# EasyEDA Pro project ProProject_AT_START_L021_V1.0.epro, board AT-START-L021_V1.0
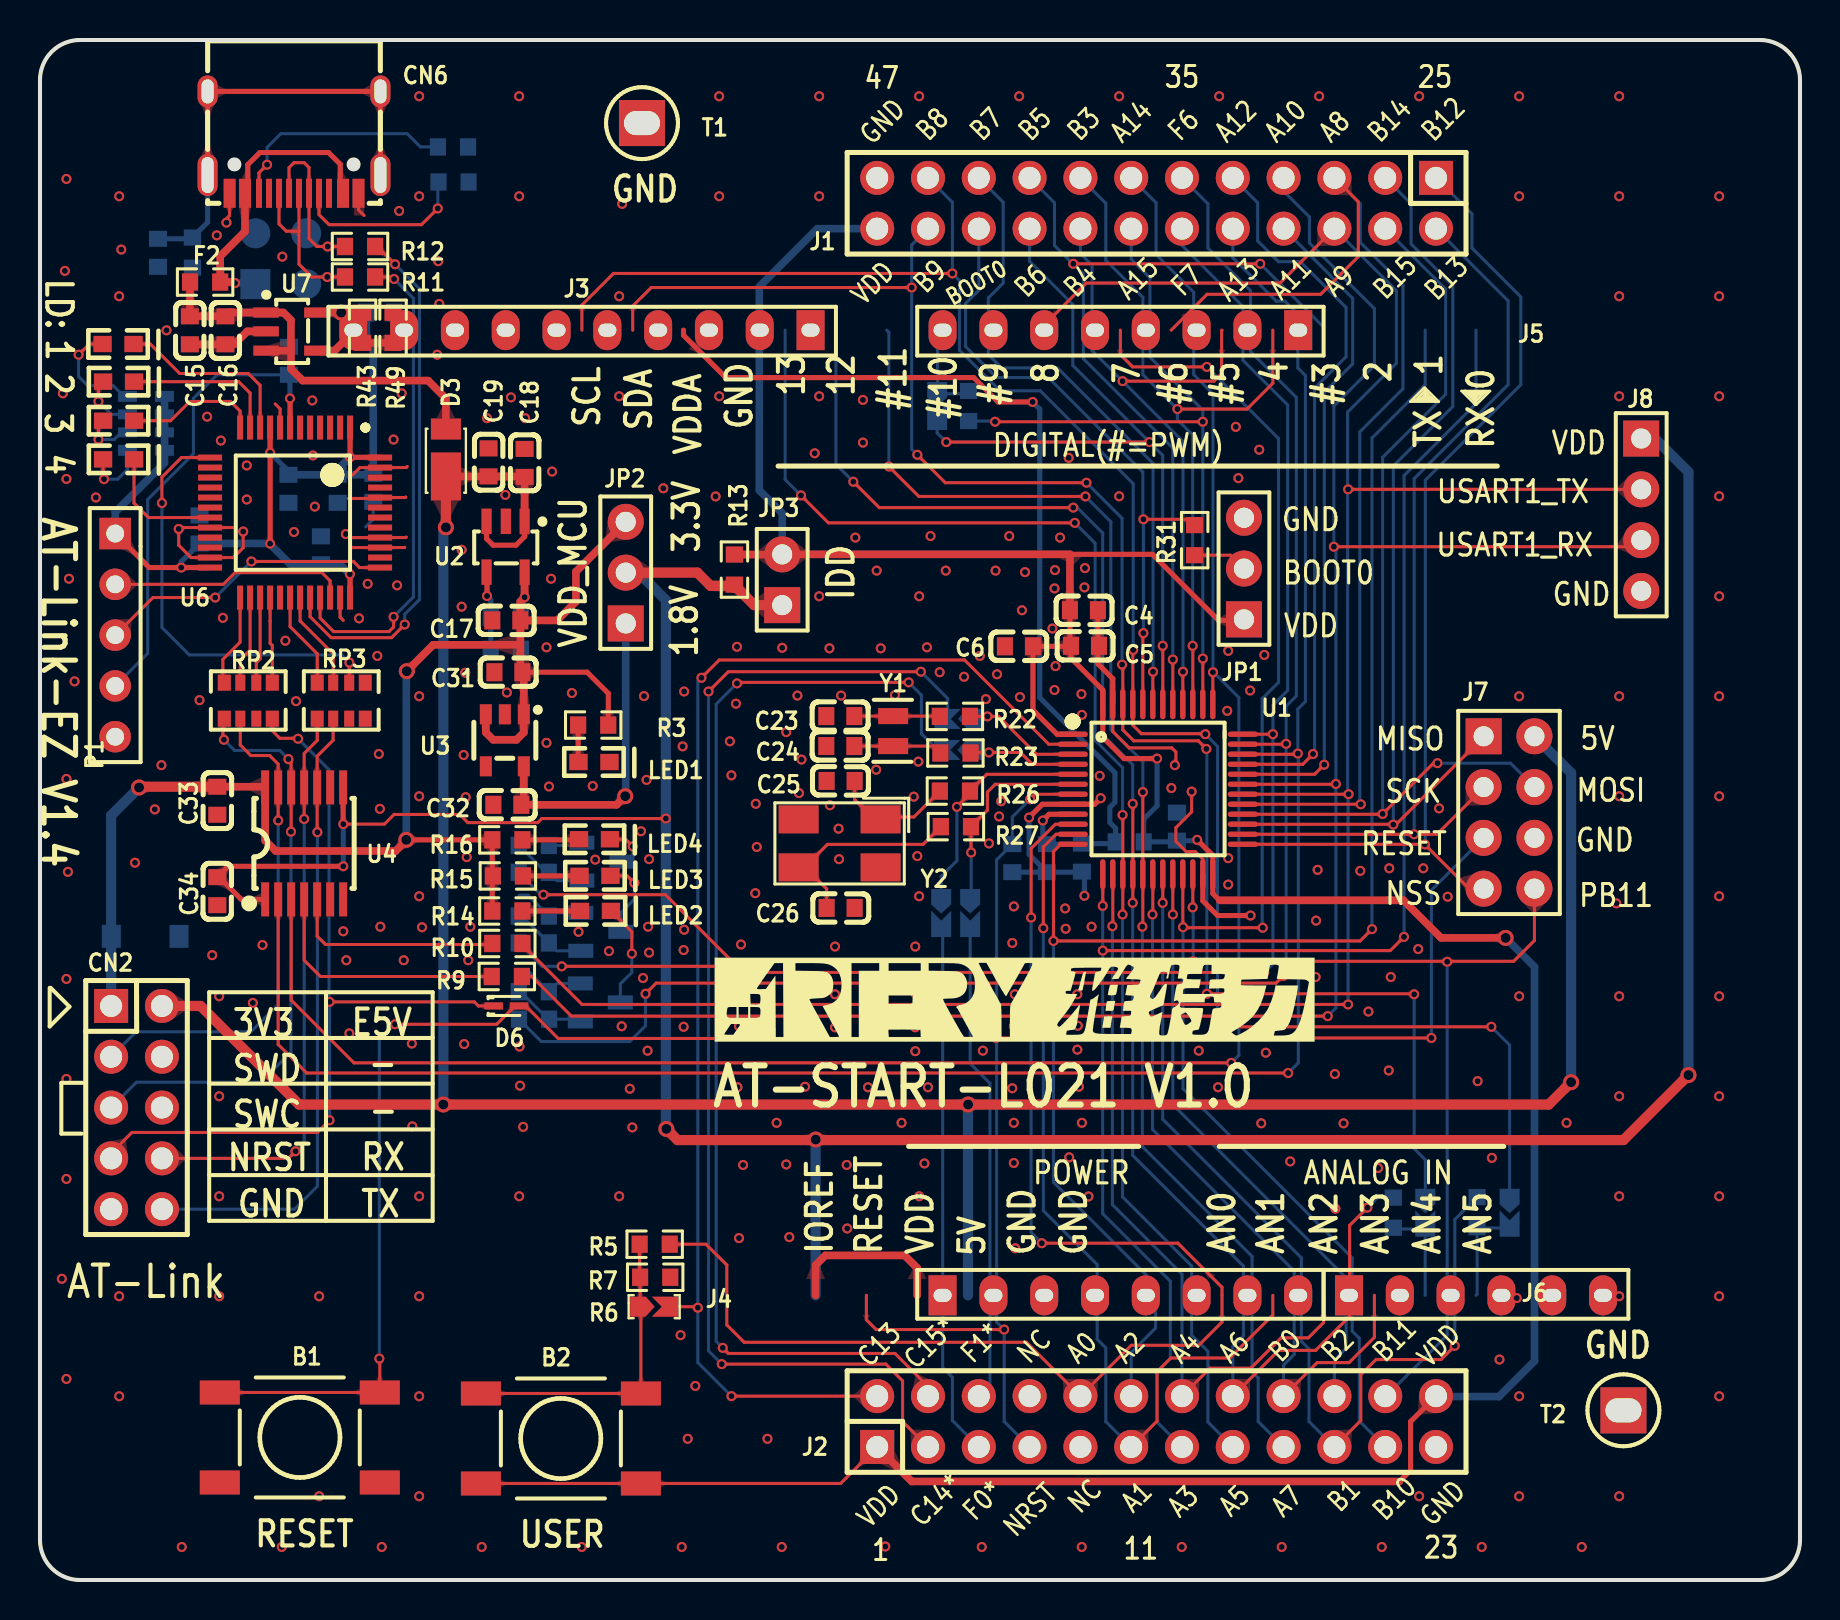
[diagram p4: board, top side]
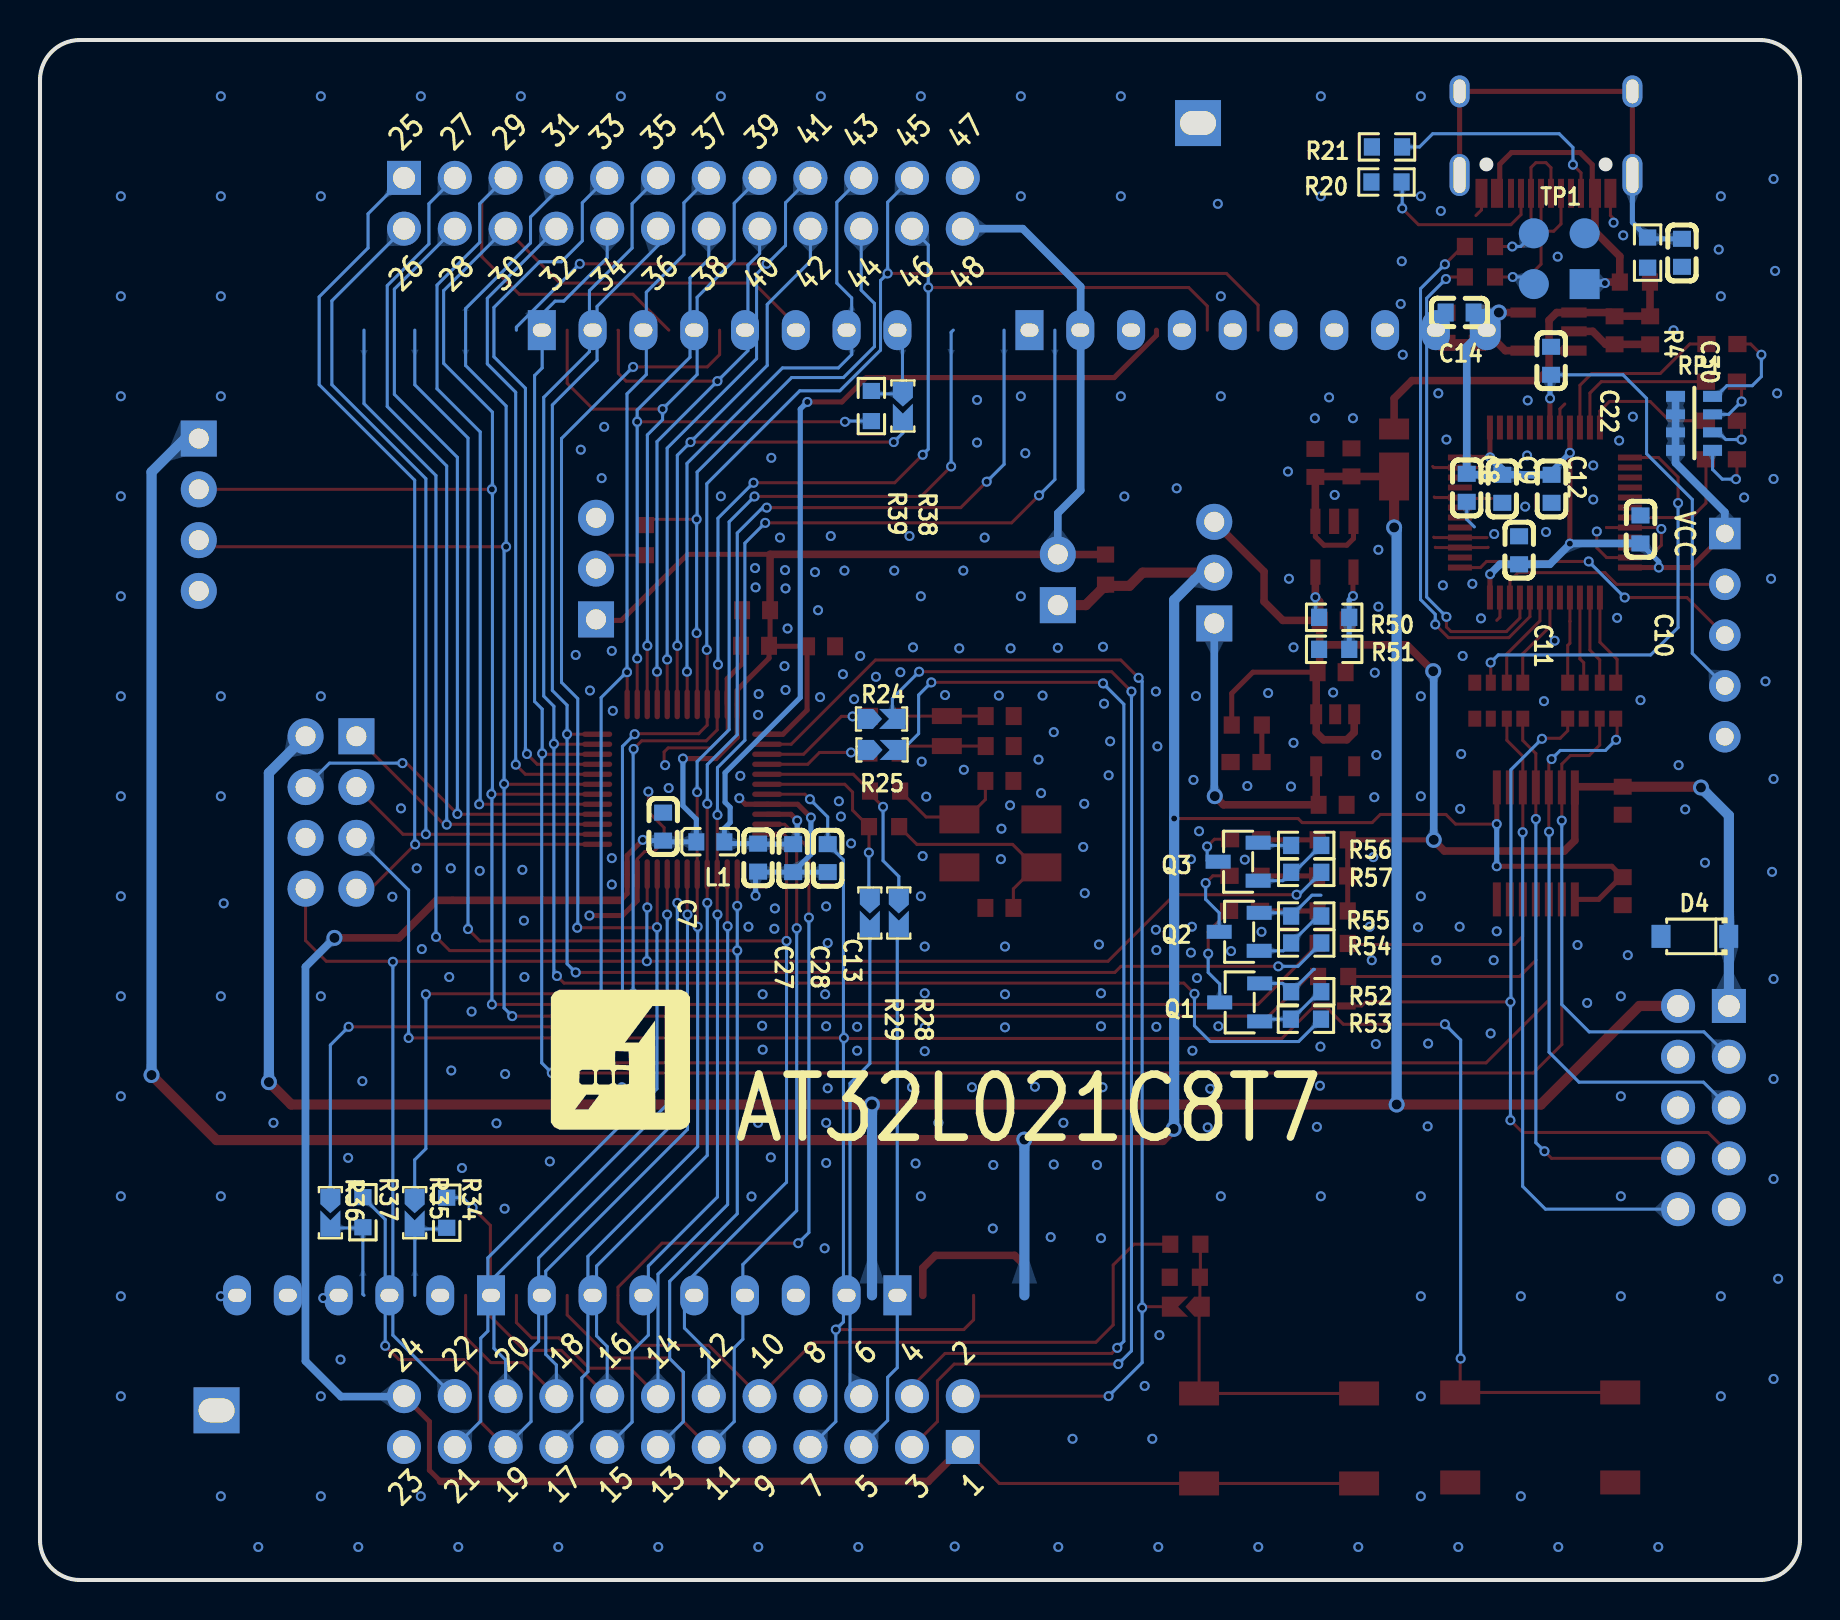
[diagram p5: board, bottom side, seen from below]

Outline 88 x 77 mm; copper layers: Top Layer, Bottom Layer. Coordinates in mm from the lower left corner of the outline.
Outline path: 0,75 0,2 arc(0.59,0.59) 2,0 86,0 arc(87.41,0.59) 88,2 88,75 arc(87.41,76.41) 86,77 2,77 arc(0.59,76.41) 0,75
Stack: Top Layer 0.035mm / Dielectric1 1.51mm FR4 er 4.5 / Bottom Layer 0.035mm

## Design rules (mm)
template: 用户自定义配置
spacing Default (default): track to track 0.152, other pairs 0 to 0.152
track width Default (default): min 0.152, default 0.152, max 25.4
differential pair differentialPair (default): width min 0.127, default 0.254, max 2.54; gap min 0.152, default 0.152
via Default (default): diameter min 0.5, default 0.5, max 100.025; hole min 0.3, default 0.3, max 59.995

## Placement (name value [footprint] x y rotation side)
B1  K2-1102SP-C4SC-04  [BUTTON_SMT_6*6*5]  12.99 7.13 0 top
B2  蓝色  [BUTTON_SMT_6*6*5]  26.05 7.08 180 top
C4  4.7uF  [C0603]  52.2 48.49 180 top
C5  100nF  [C0603]  52.25 46.71 180 top
C6  100nF  [C0603]  48.95 46.69 0 top
C7  100nF  [C0603]  56.84 37.67 270 bottom
C8  4.7uF  [C0603]  16.66 54.61 90 bottom
C9  100nF  [C0603]  14.88 54.56 90 bottom
C10  100nF  [C0603]  7.98 52.53 270 bottom
C11  100nF  [C0603]  14.05 51.49 270 bottom
C12  100nF  [C0603]  12.42 54.56 90 bottom
C13  100nF  [C0603]  48.62 36.09 90 bottom
C14  10uF  [C0603]  17.02 63.37 180 bottom
C15  10uF  [C0603]  7.49 62.48 90 top
C16  100nF  [C0603]  9.27 62.48 90 top
C17  10uF  [C0603]  23.32 47.98 0 top
C18  10uF  [C0603]  24.23 55.85 270 top
C19  100nF  [C0603]  22.43 55.88 270 top
C22  100nF  [C0603]  12.45 60.96 270 bottom
C23  18pF  [C0603]  40.02 43.2 0 top
C24  18pF  [C0603]  40.02 41.7 0 top
C25  33pF  [C0603]  40.03 39.95 0 top
C26  33pF  [C0603]  40.03 33.6 180 top
C27  1uF  [C0603]  52.1 36.12 90 bottom
C28  100nF  [C0603]  50.34 36.09 90 bottom
C30  100nF  [C0603]  5.9 66.36 90 bottom
C31  1uF  [C0603]  23.42 45.39 0 top
C32  1uF  [C0603]  23.37 38.76 0 top
C33  100nF  [C0603]  8.86 38.96 270 top
C34  100nF  [C0603]  8.86 34.44 90 top
CN2  -  [HDR-TH_10P-P2.54-V-M-R2-C5-S2.54]  4.83 23.62 270 top
CN6  -  [USB-C-SMD_TYPEC-304-BCP16]  12.7 71.88 180 top
D3  DFLS130L-7  [POWERDI-123_L2.8-W1.8-LS3.7-RD]  20.29 56.36 90 top
D4  SMF3.3A  [SOD-123_L2.8-W1.8-LS3.7-RD]  5.26 32.18 0 bottom
D6  LRB521S-40T1G  [SOD-523_L1.2-W0.8-LS1.6-RD]  23.32 28.7 0 top
F2  SMD0603B050TF  [R0603]  8.25 64.9 180 top
J1  -  [HDR-TH_24P-P2.54-V-M-R2-C12-S2.54]  55.83 68.84 180 top
J2  -  [HDR-TH_24P-P2.54-V-M-R2-C12-S2.54]  55.83 7.92 0 top
J3  -  [AT-START-Connector 1x10]  38.53 62.49 180 top
J4  -  [AT-START-Connector 1x8]  45.13 14.23 0 top
J5  -  [AT-START-Connector 1x8]  62.91 62.49 180 top
J6  -  [AT-START-Connector 1x6]  65.45 14.23 0 top
J7  Header 4X2  [HDR2X4]  72.18 42.19 270 top
J8  Header 1x4  [HDR1X4]  80.06 57.07 270 top
JP1  Header 1x3  [HEADER 1X3]  60.2 48.03 90 top
JP2  Header 1x3  [HEADER 1X3]  29.29 47.83 90 top
JP3  NC(Header 1x2)  [HDR1X2]  37.11 48.74 90 top
L1  600Ω@100MHz ±25%  [L0603]  54.48 36.91 180 bottom
LD1  RED  [LED0603]  3.13 61.79 0 top
LD2  GREEN  [LED0603]  3.15 59.91 0 top
LD3  BLUE  [LED0603]  3.16 57.96 0 top
LD4  YELLOW  [LED0603]  3.15 56.03 0 top
LED1  RED  [LED0603]  26.92 40.89 0 top
LED2  RED  [LED0603]  27 33.45 0 top
LED3  YELLOW  [LED0603]  26.97 35.2 0 top
LED4  GREEN  [LED0603]  26.95 37.03 0 top
P1  HDR-M-2.54_1x5  [HDR-M-2.54_1X5]  3.76 47.24 270 top
Q1  SS8050  [SOT-23-3_L2.9-W1.3-P1.90-LS2.4-BR]  28.02 28.88 180 bottom
Q2  SS8050  [SOT-23-3_L2.9-W1.3-P1.90-LS2.4-BR]  28.04 32.41 180 bottom
Q3  SS8050  [SOT-23-3_L2.9-W1.3-P1.90-LS2.4-BR]  28.09 35.92 180 bottom
R3  1kΩ  [R0603]  27.66 42.75 0 top
R4  1MΩ  [R0603]  7.62 66.37 270 bottom
R5  0Ω  [R0603]  30.73 16.79 0 top
R6  NC  [SB-PAD]  30.71 13.67 0 top
R7  100kΩ  [R0603]  30.76 15.14 180 top
R9  330Ω  [R0603]  23.34 30.17 0 top
R10  330Ω  [R0603]  23.37 31.83 0 top
R11  0Ω  [R0603]  16 65.15 0 top
R12  0Ω  [R0603]  16 66.67 0 top
R13  0Ω  [R0603]  34.72 50.52 90 top
R14  1kΩ  [R0603]  23.37 33.45 180 top
R15  1kΩ  [R0603]  23.39 35.2 180 top
R16  1kΩ  [R0603]  23.37 37.01 180 top
R20  5.1kΩ  [R0603]  20.68 69.9 0 bottom
R21  5.1kΩ  [R0603]  20.65 71.65 0 bottom
R22  0Ω  [R0603]  45.75 43.18 0 top
R23  0Ω  [R0603]  45.77 41.35 0 top
R24  NC  [SB-PAD]  45.92 43.05 180 bottom
R25  NC  [SB-PAD]  45.9 41.5 180 bottom
R26  0Ω  [R0603]  45.75 39.45 0 top
R27  0Ω  [R0603]  45.8 37.67 0 top
R28  NC  [SB-PAD]  45.06 33.35 270 bottom
R29  NC  [SB-PAD]  46.51 33.35 270 bottom
R31  10kΩ  [R0603]  57.73 51.99 90 top
R34  0Ω  [R0603]  67.67 18.36 270 bottom
R35  NC  [SB-PAD]  69.27 18.36 270 bottom
R36  NC  [SB-PAD]  73.48 18.36 270 bottom
R37  0Ω  [R0603]  71.86 18.39 270 bottom
R38  NC  [SB-PAD]  44.86 58.7 270 bottom
R39  0Ω  [R0603]  46.43 58.7 90 bottom
R43  47kΩ  [R0603]  16.13 62.61 90 top
R49  15kΩ  [R0603]  17.65 62.61 270 top
R50  47kΩ  [R0603]  23.29 48.13 0 bottom
R51  15kΩ  [R0603]  23.29 46.53 180 bottom
R52  100kΩ  [R0603]  24.69 29.41 180 bottom
R53  10kΩ  [R0603]  24.7 28.04 0 bottom
R54  10kΩ  [R0603]  24.69 31.85 0 bottom
R55  100kΩ  [R0603]  24.69 33.2 180 bottom
R56  100kΩ  [R0603]  24.69 36.73 180 bottom
R57  10kΩ  [R0603]  24.69 35.38 0 bottom
RP1  1K  [0603*4,8P4R]  6.22 59.18 270 bottom
RP2  330Ω  [RES-ARRAY-SMD_0603-8P-L3.2-W1.6-BL]  10.41 43.97 0 top
RP3  330Ω  [RES-ARRAY-SMD_0603-8P-L3.2-W1.6-BL]  15.06 43.97 0 top
T1  Testpoint  [TESTHOOK]  30.1 72.85 0 top
T2  Testpoint  [TESTHOOK]  79.17 8.48 180 top
TP1  1X4P_2.54F  [HDR1X4 - TOP]  13.31 62.25 270 bottom
U1  -  [LQFP-48_L7.0-W7.0-P0.50-LS9.0-BL]  55.89 39.54 270 top
U2  RT9080N-08GJ5  [SOT-23-5]  21.69 51.28 270 top
U3  ME6211C18M5G-N  [SOT-23-5_L3.0-W1.7-P0.95-LS2.8-BR]  23.24 41.99 90 top
U4  AIPTS0104TA14.TR  [TSSOP-14_L5.0-W4.4-P0.65-LS6.4-BL]  13.21 36.83 0 top
U6  AT32F403ACCT7  [LQFP48 - 2]  15.5 57.62 270 top
U7  RT9080N-08GJ5  [SOT-23-5(1)]  12.95 60.83 0 top
Y1  32.768KHz  [XTAL_SOP - FC-12M]  42.66 43.2 270 top
Y2  8MHz  [OSC-SMD_4P-L5.0-W3.2-BL]  39.98 36.83 180 top

## Footprints (pads in the part's own frame, mm; a bottom-side part is the same pattern mirrored in y, then rotated)
0603*4,8P4R
  rect 0.55x0.95 smd: 1(0,0) 4(2.7,0) 5(2.7,1.85) 8(0,1.85)
  rect 0.5x0.95 smd: 2(0.9,0) 3(1.8,0) 6(1.8,1.85) 7(0.9,1.85)
AT-START-Connector 1x6
  rect 1.4x2 hole 0.9x0.65: 1(0,0)
  oval 1.4x2 hole 0.9x0.65: 2(2.54,0) 3(5.08,0) 4(7.62,0) 5(10.16,0) 6(12.7,0)
AT-START-Connector 1x8
  rect 1.4x2 hole 0.9x0.65: 1(0,0)
  oval 1.4x2 hole 0.9x0.65: 2(2.54,0) 3(5.08,0) 4(7.62,0) 5(10.16,0) 6(12.7,0) 7(15.24,0) 8(17.78,0)
AT-START-Connector 1x10
  rect 1.4x2 hole 0.9x0.65: 1(0,0)
  oval 1.4x2 hole 0.9x0.65: 2(2.54,0) 3(5.08,0) 4(7.62,0) 5(10.16,0) 6(12.7,0) 7(15.24,0) 8(17.78,0) 9(20.32,0) 10(22.86,0)
BUTTON_SMT_6*6*5
  rect 2x1.2 smd: 1(-4,2.25) 2(4,2.25) 3(-4,-2.25) 4(4,-2.25)
C0603
  rect 0.8x0.9 smd: 1(-0.7,0) 2(0.7,0)
HDR1X2
  rect 1.8x1.8 hole 1.005x1: 1(0,0)
  round 1.8 hole 1.005x1: 2(2.54,0)
HDR1X4
  rect 1.8x1.8 hole 1: 1(0,0)
  round 1.8 hole 1: 2(2.54,0) 3(5.08,0) 4(7.62,0)
HDR1X4 - TOP
  rect 1.5x1.5 smd: 1(-2.54,2.54)
  round 1.5 smd: 2(-5.08,0) 3(-2.54,0) 4(-5.08,2.54)
HDR2X4
  rect 1.8x1.8 hole 1: 1(0,0)
  round 1.8 hole 1: 2(0,2.54) 3(2.54,0) 4(2.54,2.54) 5(5.08,0) 6(5.08,2.54) 7(7.62,0) 8(7.62,2.54)
HDR-M-2.54_1X5
  rect 1.575x1.575 hole 0.889: 1(-5.08,0)
  round 1.575 hole 0.889: 2(-2.54,0) 3(0,0) 4(2.54,0) 5(5.08,0)
HDR-TH_10P-P2.54-V-M-R2-C5-S2.54
  rect 1.7x1.7 hole 1.1: 1(-5.08,-1.27)
  round 1.7 hole 1.1: 2(-5.08,1.27) 3(-2.54,-1.27) 4(-2.54,1.27) 5(0,-1.27) 6(0,1.27) 7(2.54,-1.27) 8(2.54,1.27) 9(5.08,-1.27) 10(5.08,1.27)
HDR-TH_24P-P2.54-V-M-R2-C12-S2.54
  rect 1.7x1.7 hole 1.1: 1(-13.97,-1.27)
  round 1.7 hole 1.1: 2(-13.97,1.27) 3(-11.43,-1.27) 4(-11.43,1.27) 5(-8.89,-1.27) 6(-8.89,1.27) 7(-6.35,-1.27) 8(-6.35,1.27) 9(-3.81,-1.27) 10(-3.81,1.27) 11(-1.27,-1.27) 12(-1.27,1.27) 13(1.27,-1.27) 14(1.27,1.27) 15(3.81,-1.27) 16(3.81,1.27) 17(6.35,-1.27) 18(6.35,1.27) 19(8.89,-1.27) 20(8.89,1.27) 21(11.43,-1.27) 22(11.43,1.27) 23(13.97,-1.27) 24(13.97,1.27)
HEADER 1X3
  rect 1.8x1.8 hole 1.005x1: 1(0,-0.001)
  round 1.8 hole 1.005x1: 2(2.54,-0.001) 3(5.08,-0.001)
L0603
  rect 0.8x0.864 smd: 1(-0.701,0) 2(0.701,0)
LED0603
  rect 0.914x0.813 smd: 1(-0.001,0.005) 2(1.548,0.005)
LQFP48 - 2
  rect 1.2x0.3 smd: 1(0,0) 2(0,-0.5) 3(0,-1) 4(0,-1.5) 5(0,-2) 6(0,-2.5) 7(0,-3) 8(0,-3.5) 9(0,-4) 10(0,-4.5) 11(0,-5) 12(0,-5.5) 25(8.5,-5.5) 26(8.5,-5) 27(8.5,-4.5) 28(8.5,-4) 29(8.5,-3.5) 30(8.5,-3) 31(8.5,-2.5) 32(8.5,-2) 33(8.5,-1.5) 34(8.5,-1) 35(8.5,-0.5) 36(8.5,0)
  rect 0.3x1.2 smd: 13(1.5,-7) 14(2,-7) 15(2.5,-7) 16(3,-7) 17(3.5,-7) 18(4,-7) 19(4.5,-7) 20(5,-7) 21(5.5,-7) 22(6,-7) 23(6.5,-7) 24(7,-7) 37(7,1.5) 38(6.5,1.5) 39(6,1.5) 40(5.5,1.5) 41(5,1.5) 42(4.5,1.5) 43(4,1.5) 44(3.5,1.5) 45(3,1.5) 46(2.5,1.5) 47(2,1.5) 48(1.5,1.5)
LQFP-48_L7.0-W7.0-P0.50-LS9.0-BL
  oval 0.269x1.501 smd: 1(-2.751,-4.25) 2(-2.251,-4.25) 3(-1.75,-4.25) 4(-1.25,-4.25) 5(-0.75,-4.25) 6(-0.249,-4.25) 7(0.249,-4.25) 8(0.75,-4.25) 9(1.25,-4.25) 10(1.75,-4.25) 11(2.251,-4.25) 12(2.751,-4.25) 25(2.751,4.25) 26(2.251,4.25) 27(1.75,4.25) 28(1.25,4.25) 29(0.75,4.25) 30(0.249,4.25) 31(-0.249,4.25) 32(-0.75,4.25) 33(-1.25,4.25) 34(-1.75,4.25) 35(-2.251,4.25) 36(-2.751,4.25)
  oval 1.501x0.269 smd: 13(4.25,-2.751) 14(4.25,-2.251) 15(4.25,-1.75) 16(4.25,-1.25) 17(4.25,-0.75) 18(4.25,-0.249) 19(4.25,0.249) 20(4.25,0.75) 21(4.25,1.25) 22(4.25,1.75) 23(4.25,2.251) 24(4.25,2.751) 37(-4.25,2.751) 38(-4.25,2.251) 39(-4.25,1.75) 40(-4.25,1.25) 41(-4.25,0.75) 42(-4.25,0.249) 43(-4.25,-0.249) 44(-4.25,-0.75) 45(-4.25,-1.25) 46(-4.25,-1.75) 47(-4.25,-2.251) 48(-4.25,-2.751)
OSC-SMD_4P-L5.0-W3.2-BL
  rect 2x1.4 smd: 1(-2.05,-1.2) 2(2.05,-1.2) 3(2.05,1.2) 4(-2.05,1.2)
POWERDI-123_L2.8-W1.8-LS3.7-RD
  rect 2.4x1.5 smd: 1(-1.188,0)
  rect 1.05x1.5 smd: 2(1.188,0)
R0603
  rect 0.806x0.864 smd: 1(-0.753,0) 2(0.753,0)
RES-ARRAY-SMD_0603-8P-L3.2-W1.6-BL
  rect 0.65x0.8 smd: 1(-1.2,-0.9) 4(1.2,-0.9) 5(1.2,0.9) 8(-1.2,0.9)
  rect 0.5x0.8 smd: 2(-0.4,-0.9) 3(0.4,-0.9) 6(0.4,0.9) 7(-0.4,0.9)
SB-PAD
  custom 1.226x1 smd: 1(-0.587,0)
  custom 1.319x1 smd: 2(0.54,0)
SOD-123_L2.8-W1.8-LS3.7-RD
  rect 0.95x1.15 smd: 1(-1.692,0) 2(1.692,0)
SOD-523_L1.2-W0.8-LS1.6-RD
  rect 0.93x0.36 smd: 1(-0.635,0) 2(0.635,0)
SOT-23-3_L2.9-W1.3-P1.90-LS2.4-BR
  rect 1.25x0.7 smd: 1(1,-0.95) 2(1,0.95) 3(-1,0)
SOT-23-5
  rect 1.27x0.508 smd: 1(-1.651,2.54) 2(-1.651,1.6) 3(-1.651,0.635) 4(0.889,0.635) 5(0.889,2.54)
SOT-23-5(1)
  rect 1.27x0.508 smd: 1(-1.651,2.54) 2(-1.651,1.6) 3(-1.651,0.635) 4(0.889,0.635) 5(0.889,2.54)
SOT-23-5_L3.0-W1.7-P0.95-LS2.8-BR
  rect 1x0.6 smd: 1(1.3,-0.95) 2(1.3,0) 3(1.3,0.95) 4(-1.3,0.95) 5(-1.3,-0.95)
TESTHOOK
  rect 2.3x2.3 hole 1.8x1.2: 1(0,0)
TSSOP-14_L5.0-W4.4-P0.65-LS6.4-BL
  rect 0.4x1.7 smd: 1(-1.95,-2.8) 2(-1.3,-2.8) 3(-0.65,-2.8) 4(0,-2.8) 5(0.65,-2.8) 6(1.3,-2.8) 7(1.95,-2.8) 8(1.95,2.8) 9(1.3,2.8) 10(0.65,2.8) 11(0,2.8) 12(-0.65,2.8) 13(-1.3,2.8) 14(-1.95,2.8)
USB-C-SMD_TYPEC-304-BCP16
  oval 1.001x2.1 hole 0.6x1.801: 13(-4.321,1.633) 14(4.321,1.633)
  oval 1.001x1.6 hole 0.6x1.199: 15(-4.321,-2.547) 16(4.321,-2.547)
  rect 0.6x1.45 smd: A1B12(-3.226,2.547) A4B9(-2.451,2.547) B1A12(3.22,2.547) B4A9(2.451,2.547)
  rect 0.299x1.45 smd: A5(-1.25,2.547) A6(-0.249,2.547) A7(0.249,2.547) A8(1.25,2.547) B5(1.75,2.547) B6(0.75,2.547) B7(-0.75,2.547) B8(-1.75,2.547)
XTAL_SOP - FC-12M
  rect 0.8x1.5 smd: 1(0,0) 2(1.5,0)

## Nets
As in the schematic.

Pads without a net: CN2 4 6; CN6 A8 B8; J2 8 9; J4 1 8; RP2 3; RP3 3 4 5; U3 4; U4 6 9; U6 2 3 4 5 6 14 15 16 17 18 21 22 29 38 41 42 43 45 46

## Via types
v1: diameter 0.5, hole 0.3, Top Layer to Bottom Layer, 308 vias
v2: diameter 0.5, hole 0.299, Top Layer to Bottom Layer, 181 vias
v3: diameter 0.8, hole 0.5, Top Layer to Bottom Layer, 13 vias

## Routing (per net, layer and track width the routed paths; a pad name or vN(x,y) marks a point on that pad's centre or on a via; arc(x,y) is an arc through that point)
1V8: length 16
  Top Layer w0.381: U3.5 24.19,38.88 C32.2 28.83,38.76 v3(29.26,39.19)
  Bottom Layer w0.381: v3(29.26,39.19) 29.29,39.22 JP2.1
3V3: length 77.4
  Top Layer w0.254: R3.2 28.41,44.33 27.36,45.39 C31.2 ; v3(18.31,37.01) R16.2 R14.2
  Top Layer w0.381: JP2.3 26.8,50.42 26.8,48.92 25.86,47.98 24.02,47.98 ; 24.02,46.76 19.66,46.76 v3(18.34,45.44) ; 24.02,46.76 24.02,47.98 ; 24.02,46.76 24.02,45.49 C31.2 24.19,45.32 U3.1 24.19,42.38 23.82,42.01 22.66,42.01 22.29,42.38 U3.3 ; C33.1 11.22,39.66 U4.14 11.26,36.98 11.79,36.45 17.78,36.45 18.31,36.98 v3(18.31,37.01) ; U2.5 v1(24.23,49.14) 24.02,48.93 24.02,47.98
  Top Layer w0.508: v3(4.95,39.62) 4.99,39.66 C33.1
  Bottom Layer w0.152: v1(24.23,49.14) 24.23,48.32 R50.2
  Bottom Layer w0.381: v3(18.31,37.01) 18.31,45.42 v3(18.34,45.44)
  Bottom Layer w0.508: D4.1 3.56,32.17 ; 3.56,32.17 3.56,38.23 v3(4.95,39.62) ; 3.56,32.17 CN2.1
GND: length 70.7
  Top Layer w0.152: 9.68,52.63 9.67,52.62 U6.20 7,52.62 v1(6.93,52.55) 6.93,51.74 7.55,51.12 U6.23 9.67,51.12 10.16,51.61 v1(10.16,52.43) ; 15.62,55.25 16,55.62 U6.47 18.31,55.62 18.36,55.68 ; CN6.B1A12 9.48,68.23 9.14,67.89 ; CN6.A1B12 15.93,68.5 16.2,68.22 ; 15.16,47.98 15,48.14 U6.35 ; 18.29,54.15 18.26,54.12 U6.44 16.96,54.08 15.42,54.08 ; U6.8 12,58.56 11.76,58.8 ; 15.6,51.64 15.61,51.62 U6.39 18.22,51.62 18.24,51.64 ; 18.31,52.15 18.29,52.12 U6.40 ; v2(57.58,39.42) 57.58,38.4 56.79,37.62 56.79,36.93 57.3,36.42 57.76,36.42 58.14,36.04 U1.23 ; v2(56.74,40.74) 56.79,40.79 56.79,41.4 56.59,41.61 54.46,41.61 53.64,42.42 53.64,43.79 ; 17,52.12 15.65,52.12
  Top Layer w0.254: v1(60.53,33.22) 58.88,33.22 58.14,33.96 U1.23 ; 53.64,43.79 53.64,45.06 52.9,45.81 C4.1 ; v2(49.45,38.12) 50.12,38.79 U1.8 52.73,38.79 v1(53.03,39.09)
  Top Layer w0.381: U7.2 10.36,62.43 9.71,61.78 C16.1 C15.1
  Bottom Layer w0.152: 16.28,52.65 16.66,53.03 C8.1 ; Q3.2 26.96,36.73 R56.1 ; 57.61,39.45 57.53,39.52 57.48,39.52 v2(57.58,39.42) ; Q2.2 25.6,33.36 R55.1 24.4,34.24 23.95,34.24 ; 24.28,30.53 24.32,30.53 R52.1 25.86,29.83 Q1.2
  Bottom Layer w0.254: 52.07,35.39 52.22,35.24 v2(52.22,34.21) ; 52.07,35.39 C27.1 ; 52.07,35.39 C28.1 ; C13.1 C28.1 ; C28.1 49.45,36.28 v2(49.45,38.12)
  vias: v1(3.96,69.19) v1(3.96,64.19) v1(3.96,14.19) v1(3.96,9.19) v1(8.96,29.19) v1(8.96,24.19) v1(8.96,19.19) v1(8.96,14.19) v1(12.7,52.4) v1(13.64,56.22) v1(13.74,53.67) v1(13.96,14.19) v1(13.96,4.19) v1(15.29,52.3) v1(15.32,30.99) v1(15.47,27.33) v1(16.94,41.3) v1(16.99,38.56) v1(18.62,22.68) v1(18.96,74.19) v1(18.96,69.19) v1(18.96,44.19) v1(18.96,39.19) v1(18.96,34.19) v1(18.96,19.19) v1(18.96,14.19) v1(18.96,9.19) v1(18.96,4.19) v1(21.08,51.51) v1(21.08,48.67) v1(21.26,45.36) v1(21.18,41.25) v1(21.21,26.8) v1(21.28,39.14) v1(21.34,36.14) v1(21.41,30.99) v1(21.51,32.66) v1(22.35,58.09) v1(23.27,54.25) v1(23.34,44.37) v1(23.55,59.13) v1(23.96,74.19) v1(23.96,69.19) v1(23.96,19.19) v1(23.98,26.67) v1(24.16,22.66) v1(24.26,58.09) v1(25.32,46.63) v1(25.32,41.86) v1(25.45,39.67) v1(25.55,50.06) v1(25.6,55.42) v1(26.59,44.35) v1(26.92,32.41) v1(27.63,39.7) v1(27.76,36.02) v1(28.45,31.45) v1(28.96,64.19) v1(28.96,59.19) v1(28.96,19.19) v1(29.11,68.81) v1(29.08,27.69) v1(29.62,22.63) v1(30.05,37.44) v1(30.15,30.1) v1(30.45,36.04) v1(30.4,32.66) v1(30.45,31.37) v1(30.38,26.47) v1(31.17,54.58) v1(32.21,32.51) v1(32.18,31.5) v1(32.18,27.66) v1(33.78,54.18) v1(33.96,74.19) v1(33.96,69.19) v1(33.96,59.19) v1(34.95,29.34) v1(34.95,27.69) v1(34.87,24.64) v1(35.05,31.78) v1(38.25,24.66) v1(38.96,74.19) v1(38.96,69.19) v1(38.96,59.19) v1(38.96,49.19) v1(39.5,38.73) v1(39.75,31.67) v1(39.75,29.29) v1(39.75,27.64) v1(41.4,24.64) v1(42.75,44.25) v1(43.76,31.67) v1(43.76,29.34) v1(43.76,27.64) v1(43.76,26.44) v1(43.96,74.19) v1(43.96,49.19) v1(43.96,34.19) v1(43.96,19.19) v1(44.4,24.64) v1(47.14,27.66) v1(47.14,26.47) v1(48.74,29.29) v1(48.69,27.69) v1(48.96,74.19) v1(49.1,48.49) v1(51.87,29.29) v1(51.89,27.71) v1(51.87,26.52) v1(51.94,24.66) v1(53.96,74.19) v1(53.96,54.19) v1(57.94,26.47) v1(58.96,74.19) v1(59.41,36.09) v1(59.41,34.77) v1(61.29,26.36) v1(63.78,30.15) v1(63.96,74.19) v1(64.77,18.57) v1(66.42,28.42) v1(67.54,30.15) v1(68.96,74.19) v1(68.96,4.19) v1(73.84,14.1) v1(73.96,74.19) v1(73.96,69.19) v1(73.96,44.19) v1(73.96,29.19) v1(73.96,9.19) v1(73.96,4.19) v1(78.82,33.83) v1(78.96,74.19) v1(78.96,69.19) v1(78.96,64.19) v1(78.96,59.19) v1(78.96,44.19) v1(78.96,39.19) v1(78.96,29.19) v1(78.96,24.19) v1(78.96,19.19) v1(78.96,14.19) v1(78.96,4.19) v1(83.96,69.19) v1(83.96,64.19) v1(83.96,59.19) v1(83.96,54.19) v1(83.96,49.19) v1(83.96,44.19) v1(83.96,39.19) v1(83.96,34.19) v1(83.96,29.19) v1(83.96,24.19) v1(83.96,19.19) v1(83.96,14.19) v1(83.96,9.19) v2(1.14,59.33) v2(1.09,15.06) v2(1.24,65.46) v2(1.32,70.05) v2(1.32,55.05) v2(1.32,40.05) v2(1.32,30.05) v2(1.32,25.05) v2(1.32,20.05) v2(1.32,10.05) v2(1.45,50.06) v2(1.4,35.41) v2(1.73,44.93) v2(2.79,54.13) v2(4.06,66.52) v2(4.75,35.86) v2(5.74,38.53) v2(6.07,40.74) v2(6.32,62.48) v2(7.09,1.65) v2(7.98,43.99) v2(8.36,58.17) v2(8.61,31.24) v2(8.84,67.23) v2(9.04,56.97) v2(9.14,48.11) v2(9.32,67.87) v2(10.34,55.73) v2(10.34,54.03) v2(10.64,28.85) v2(11.12,31.75) v2(12.12,66.17) v2(12.09,1.65) v2(12.27,46.96) v2(12.8,43.94) v2(13.61,58.98) v2(15.16,32.44) v2(15.95,48.08) v2(16.38,49.81) v2(16.87,46.2) v2(17.02,32.66) v2(17.09,1.65) v2(17.68,57.02) v2(17.86,49.73) v2(17.96,68.45) v2(18.09,59.33) v2(18.19,30.99) v2(18.59,26.82) v2(19.1,32.64) v2(19.86,61.26) v2(19.91,65.94) v2(19.96,63.8) v2(22.09,1.65) v2(24,24.71) v2(27.09,1.65) v2(29.49,24.56) v2(30.2,44.2) v2(30.33,40) v2(32.03,12.24) v2(32.13,41.68) v2(32.09,1.65) v2(32.21,44.42) v2(32.38,7.06) v2(32.77,9.7) v2(34.49,41.94) v2(34.57,40.23) v2(34.85,46.66) v2(34.8,43.81) v2(34.95,17.09) v2(35.15,20.75) v2(35.76,34.34) v2(35.79,38.81) v2(35.84,36.65) v2(36.37,7.06) v2(36.83,22.86) v2(37.11,46.61) v2(37.09,1.65) v2(37.31,42.39) v2(37.31,20.78) v2(37.47,17.14) v2(37.87,44.22) v2(37.95,39.34) v2(38.07,41.02) v2(38.74,56.34) v2(39.47,46.58) v2(39.93,37.57) v2(39.95,36.04) v2(40.06,44.22) v2(40.34,20.75) v2(40.36,17.58) v2(40.77,52.12) v2(41.15,59) v2(41.15,56.87) v2(41.83,50.47) v2(41.81,40.51) v2(42.04,46.58) v2(42.27,1.68) v2(43.08,22.86) v2(43.69,39.17) v2(43.92,40.92) v2(43.87,36.2) v2(44.22,20.83) v2(44.35,46.63) v2(44.53,52.2) v2(44.98,45.39) v2(45.29,50.47) v2(46.2,45.16) v2(46.99,46.2) v2(47.09,1.65) v2(47.3,44.04) v2(47.45,36.83) v2(47.78,50.47) v2(47.85,45.29) v2(47.96,38.18) v2(48.06,38.94) v2(48.46,52.2) v2(48.62,31.85) v2(48.62,24.59) v2(48.69,33.68) v2(48.69,22.86) v2(48.69,20.85) v2(48.77,16.59) v2(49,44.14) v2(49.25,50.39) v2(50.62,47.57) v2(50.75,50.5) v2(50.72,49.58) v2(50.72,44.5) v2(50.77,45.69) v2(51,52.12) v2(51.26,33.58) v2(51.28,32.56) v2(51.44,56.11) v2(51.46,21.13) v2(52.07,44.3) v2(52.1,43.26) v2(52.1,22.86) v2(52.09,1.65) v2(52.25,50.6) v2(52.22,49.63) v2(52.43,19.18) v2(52.58,32.66) v2(52.98,40.21) v2(56.57,39.6) v2(57.09,1.65) v2(58.9,24.64) v2(59.36,43.46) v2(59.41,46.46) v2(59.79,57.66) v2(59.92,55.09) v2(60.5,44.47) v2(60.96,56.52) v2(61.06,22.83) v2(61.21,46.25) v2(62.09,1.65) v2(62.51,20.93) v2(63.81,32.97) v2(63.88,35.51) v2(64.74,25.3) v2(65.18,22.83) v2(66.01,35.46) v2(66.9,20.6) v2(67.09,1.65) v2(67.46,35.59) v2(67.44,25.48) v2(68.91,31.55) v2(69.16,35.59) v2(69.95,38.58) v2(70.38,34.16) v2(71.88,24.94) v2(72.09,1.65) v2(72.59,21.11) v2(72.97,11.02) v2(76.33,22.86) v2(77.09,1.65)
VCC: length 51.7
  Top Layer w0.254: U6.9 11.5,56.36 v1(11.51,56.36) v1(11.51,51.82) ; U6.24 v1(7.06,50.62) 5.46,50.62 P1.1 ; U6.36 15.5,50.28 v1(15.49,50.29) ; U6.1 15.5,56.14 v1(15.49,56.13) 16.99,56.13 U6.48
  Top Layer w0.381: R43.2 16.12,63.37 v3(15.06,63.37) U7.5
  Bottom Layer w0.254: 11.48,51.83 11.5,51.82 v1(11.51,51.82) ; v1(11.51,56.36) 12.42,55.45 C12.2 ; C10.2 7.06,50.91 v1(7.06,50.62)
  Bottom Layer w0.381: RP1.1 RP1.2 RP1.3 RP1.4 6.22,55.85 3.76,53.39 P1.1 ; v3(15.06,63.37) C14.2 16.32,62.02 16.66,61.67 C8.2 16.61,55.26 C9.2 ; C9.2 14.88,55.52 v1(15.49,56.13) ; C9.2 C12.2 ; C10.2 11.48,51.83 11.48,51.81 12.51,50.79 C11.2 15,50.79 v1(15.49,50.29)
VDD: length 174.1
  Top Layer w0.152: J2.1 40.03,4.83 B2.1 22.05,4.83
  Top Layer w0.254: 67.39,33.98 67.44,33.93 ; 51.5,51.28 55.63,51.28 58.93,47.98 60.15,47.98 JP1.1 ; J2.24 68.53,7.92 68.53,5.49 67.97,4.93 ; U1.1 50.85,42.29 49.65,43.5 C6.2 51.52,46.69 C5.2 ; C4.2 51.5,46.76 C5.2 ; C5.2 51.55,46.09 53.14,44.5 53.14,42.14 54.2,41.07 v1(55.85,41.07) ; v1(57.86,37.01) 58.64,36.23 58.64,34.32 58.98,33.98
  Top Layer w0.381: R13.2 37.1,51.27 JP3.2 51.5,51.28 C4.2 ; v3(73.28,32.11) 70.05,32.11 68.17,33.98 58.98,33.98 ; 67.97,4.93 43.59,4.93 J2.1
  Bottom Layer w0.254: v1(55.85,41.07) 55.85,38.71 55.18,38.04 L1.1 57.08,36.91 ; v1(57.86,37.01) 57.82,36.97 56.97,36.97
  Bottom Layer w0.381: v3(73.28,32.11) 74.73,30.66 74.73,10.95 72.95,9.17 69.82,9.17 J2.24 ; JP3.2 37.11,53.34 35.97,54.48 35.97,64.67 38.86,67.57 J1.24
VDD_MCU: length 169.7
  Top Layer w0.152: v1(31.29,38.07) 25.09,38.07 24.89,37.87 21.39,37.87 20.98,38.28 17.7,38.28 17.22,37.8 v1(15.16,37.8)
  Top Layer w0.254: U4.8 15.16,37.8 v1(15.16,37.8) ; U4.1 10.06,34.03 8.95,35.14 C34.2 9.41,35.69 v1(15.16,35.69)
  Top Layer w0.381: R13.1 34.72,49.61 ; 38.78,14.23 38.78,15.74 39.27,16.23 43.23,16.23 43.86,15.6 43.86,14.23
  Top Layer w0.508: v3(31.32,22.56) 31.88,22 38.8,22 ; 38.8,22 79.17,22 v3(82.42,25.25) ; 38.8,22 38.8,22.01 v3(38.79,22.02) ; JP2.2 32.87,50.37 33.53,49.71 34.62,49.71 34.72,49.61 34.85,49.61 35.71,48.74 JP3.1
  Bottom Layer w0.254: v1(15.16,37.8) v1(15.16,35.69)
  Bottom Layer w0.508: JP2.2 29.92,50.37 31.29,49 v1(31.29,38.07) 31.29,22.56 31.31,22.56 v3(31.32,22.56) ; v3(82.42,25.25) 82.42,55.4 80.75,57.07 J8.1 ; 38.78,14.23 38.78,22.02 v3(38.79,22.02)
VDDA: length 49.4
  Top Layer w0.254: v1(49.63,58.9) 47.9,58.9 46.69,60.12 34.29,60.12 32.18,62.24 32.18,62.49 ; v1(50.14,37.97) 50.45,38.29 U1.9
  Bottom Layer w0.254: v1(49.63,58.9) 49.99,58.55 49.99,44.12 53.75,40.36 53.75,38.89 53.49,38.63 53.49,37.87 53.78,37.58 L1.2 53.69,36.82 C27.2 52.07,36.79 C28.2 50.14,37 v1(50.14,37.97)
ATLINK_5V: length 14.9
  Top Layer w0.254: CN6.B4A9 10.39,69.47 10.39,70.76 11,71.37 14.43,71.37 15.01,70.79 15.01,69.47 CN6.A4B9
  Top Layer w0.381: CN6.B4A9 10.25,67.42 9.01,66.18 F2.1 9.7,64.9 v1(9.75,64.85)
  Bottom Layer w0.381: v1(9.75,64.85) 10.72,64.85 TP1.1
ATLK_NRST: length 41.9
  Top Layer w0.152: 11.61,43.07 11.61,42.46 11.99,42.09 12.88,42.09 v1(12.9,42.06) ; CN2.7 3.56,21.34 4.6,22.38 13.87,22.38 v1(14.48,22.99) ; v1(14.48,28.91) 21.72,28.91 21.92,28.7 D6.1
  Bottom Layer w0.152: v1(12.9,42.06) 14.45,40.51 14.45,28.93 v1(14.48,28.91) v1(14.48,22.99)
ATLK_RX: length 32
  Top Layer w0.152: 14.66,43.07 14.66,43.06 14.66,41.99 13.86,41.19 U4.10 13.86,37.4 v1(13.87,37.39)
  Bottom Layer w0.152: v1(13.87,37.39) 13.87,19.69 12.73,18.54 CN2.10
ATLK_SWCLK: length 29.7
  Top Layer w0.152: v1(12.55,37.41) 12.56,37.42 U4.12 12.56,40.91 v1(12.42,41.05) ; 9.14,43.21 9.14,42.06 v1(9.2,42.01)
  Bottom Layer w0.152: v1(12.55,37.41) 12.55,26.39 11.05,24.89 4.83,24.89 CN2.5 ; v1(12.42,41.05) 11.99,41.48 9.73,41.48 v1(9.2,42.01)
ATLK_SWDIO: length 25.1
  Top Layer w0.152: v1(11.91,37.97) 11.91,37.98 U4.13 11.91,40.8 11.48,41.22 10.54,41.22 10.01,41.75 10.01,43.07
  Bottom Layer w0.152: v1(11.91,37.97) 11.91,28.78 10.54,27.41 4.8,27.41 CN2.3
ATLK_TX: length 28.9
  Top Layer w0.152: 13.86,43.07 13.86,41.98 13.21,41.33 U4.11 v1(13.21,38.05) ; v2(12.78,21.44) 12.42,21.08 CN2.8
  Bottom Layer w0.152: v2(12.78,21.44) 13.21,21.87 v1(13.21,38.05)
BOOT0: length 32
  Top Layer w0.152: 55.14,43.79 55.14,47.32 v1(55.17,47.35) ; v1(55.17,53.03) 57.45,53.03 R31.2
  Bottom Layer w0.152: v1(55.17,47.35) 55.17,53 55.14,53.03 ; 55.14,53.03 55.14,55.4 50.42,60.12 47.83,60.12 46.28,61.67 46.28,63.83 46.94,64.49 J1.20 ; 55.14,53.03 55.15,53.03 v1(55.17,53.03)
CC1: length 8.9
  Top Layer w0.152: CN6.A5 13.95,68.27 14.45,67.77 19.08,67.77 v1(19.89,68.58)
  Bottom Layer w0.152: R20.1 19.89,69.87 v1(19.89,68.58)
CC2: length 11.6
  Top Layer w0.152: v1(11.35,70.76) 10.95,70.36 CN6.B5
  Bottom Layer w0.152: R21.1 19.02,71.65 18.36,72.31 12.04,72.31 11.35,71.63 v1(11.35,70.76)
E5V: length 142
  Top Layer w0.254: U2.1 24.23,52.17 23.8,51.74 22.66,51.74 22.33,52.07 U2.3
  Top Layer w0.381: D3.1 24.21,55.17 C18.2 U2.1
  Top Layer w0.508: v3(76.56,24.89) 75.44,23.77 v3(46.41,23.77) v3(20.17,23.77) 12.95,23.77 8.03,28.7 CN2.2 ; D3.1 v3(20.29,52.63)
  Bottom Layer w0.508: v3(76.56,24.89) 76.56,40.35 J7.2 ; v3(46.41,23.77) 46.4,23.77 46.4,14.23 ; v3(20.29,52.63) 20.17,52.5 v3(20.17,23.77)
EGND: length 22.2
  Top Layer w0.254: 8.38,70.25 CN6.16 CN6.15 17.02,70.25
  Bottom Layer w0.254: C30.2 7.56,67.06 R4.1 8.38,67.88 8.38,70.25
LD1: length 9.3
  Top Layer w0.152: U6.10 11,59.73 10.41,60.33 6.98,60.33 5.51,61.8 4.68,61.8
LD2: length 7.8
  Top Layer w0.152: U6.11 10.5,59.35 9.93,59.92 LD2.2
LD3: length 6.7
  Top Layer w0.152: U6.12 10,58.45 9.53,58.93 7.49,58.93 6.53,57.96 LD3.2
LD4: length 6.3
  Top Layer w0.152: U6.19 5.42,53.12 4.7,53.84 4.7,56.03
M-ATLK_RX: length 4.9
  Top Layer w0.152: U6.31 13,47.96 14.66,46.3 RP3.7
M-ATLK_TX: length 4.8
  Top Layer w0.152: U6.30 12.5,47.67 13.86,46.31 RP3.8
M-NRST: length 23.9
  Top Layer w0.254: v1(12.5,59.08) 12.5,59.07 U6.7
  Bottom Layer w0.152: C22.2 8.85,60.26 7.67,59.08 7.67,56.31 5.39,54.03 5.39,46.33 P1.4
  Bottom Layer w0.254: v1(12.5,59.08) 12.5,60.21 C22.2
M-SWCLK: length 14.9
  Top Layer w0.152: v1(10.57,50.93) 15.67,50.93 15.98,50.62 U6.37 ; v1(8.76,49.12) 5.65,49.12 3.77,47.24 P1.3
  Bottom Layer w0.152: v1(8.76,49.12) v1(10.57,50.93)
M-SWDIO: length 12
  Top Layer w0.152: U6.34 14.5,49.96 14.1,50.37 9.75,50.37 9.17,49.78 P1.2
M-USB_D+: length 24.3
  Top Layer w0.152: v1(17.68,48.16) 17.68,47.65 17.45,47.42 14.68,47.42 14,48.1 U6.33 ; v1(17.7,65.05) 17.6,65.15 R11.2
  Bottom Layer w0.152: v1(17.7,65.05) 18.67,64.08 18.67,49.15 v1(17.68,48.16)
M-USB_D-: length 26.6
  Top Layer w0.152: v1(17.75,65.79) 16.87,66.67 R12.2 ; U6.32 13.5,48.17 14.56,47.12 17.58,47.12 v1(18.24,47.78)
  Bottom Layer w0.152: v1(18.24,47.78) 18.24,48.29 18.97,49.02 18.97,64.57 v1(17.75,65.79)
M_ATLK_BOOT0: length 4.3
  Top Layer w0.152: U6.27 11,46.06 10.81,45.87 RP2.6
M_ATLK_NRST: length 4.3
  Top Layer w0.152: RP2.5 11.61,46.73 11.51,46.84 11.51,47.94 11.5,47.94 U6.28
M_ATLK_SWCLK: length 4.8
  Top Layer w0.152: 9.14,44.72 9.14,46.03 10,46.89 U6.25
M_ATLK_SWDIO: length 4.5
  Top Layer w0.152: RP2.7 10.01,46.01 10.5,46.5 U6.26
M_ATLK_SWO: length 21.4
  Top Layer w0.152: RP3.6 15.46,45.87 v1(15.47,45.87) ; v1(6.1,53.85) 6.1,55.14 7.08,56.12 U6.13
  Bottom Layer w0.152: v1(6.1,53.85) 6.1,47.62 7.47,46.25 15.09,46.25 v1(15.47,45.87)
NRST: length 135.2
  Top Layer w0.152: B1.1 B1.2 16.99,11.05 v1(16.97,11.07) ; 41.32,14.23 41.32,13.01 41.81,12.52 v1(48.21,12.52) ; v1(17.75,27.79) 22.83,27.79 23.75,28.7 D6.2 24.28,28.7 25.91,27.08 47.78,27.08 v1(47.8,27.1) v1(69.57,27.1) ; U1.7 49.75,39.29 v1(49.5,39.04)
  Bottom Layer w0.152: v1(69.57,27.1) 69.57,34.5 J7.5 ; 47.83,26.93 47.8,26.96 v1(47.8,27.1) ; 47.83,26.93 47.83,36.01 C13.2 48.62,38.15 v1(49.5,39.04) ; 47.83,26.93 47.83,12.9 v1(48.21,12.52) 48.21,7.92 J2.7 ; v1(17.75,27.79) 16.97,27 v1(16.97,11.07)
PA0: length 68.3
  Top Layer w0.152: R5.2 33.3,16.79 34.34,15.75 34.34,12.75 35.2,11.89 49.33,11.89 J2.10 54.56,11.73 57.94,11.73 59.1,12.9 59.1,14.64 56.9,16.84 v1(50.09,16.84) ; U1.10 50.77,37.79 49.56,36.58 v1(49.56,33.12)
  Bottom Layer w0.152: v1(50.09,16.84) 49.56,17.37 v1(49.56,33.12)
PA1: length 45.8
  Top Layer w0.152: J2.11 55.85,7.95 55.85,10.41 56.54,11.1 59.49,11.1 61.64,13.25 61.64,14.23 ; 51.64,37.29 50.8,37.29 50.16,36.65 v1(50.16,32.59)
  Bottom Layer w0.152: J2.11 53.29,7.92 53.29,11.61 52.86,12.04 52.86,15.77 50.16,18.47 v1(50.16,32.59)
PA2: length 78.2
  Top Layer w0.152: U1.12 51.04,36.79 50.67,36.42 v1(50.67,31.95) 66.01,31.95 v1(66.6,32.55)
  Bottom Layer w0.152: v1(66.6,32.55) 66.6,57.1 69.26,59.76 69.26,62.49 ; J2.12 54.56,11.38 55.78,12.6 55.78,14.78 50.67,19.89 v1(50.67,31.95)
PA3: length 78
  Top Layer w0.152: U1.13 53.14,33.71 v1(53.14,33.71) ; v1(53.14,31.47) 67.51,31.47 v1(68.2,32.16)
  Bottom Layer w0.152: v1(53.14,33.71) v1(53.14,31.47) 53.14,18.31 56.52,14.94 56.52,11.07 55.83,10.39 55.83,7.92 J2.13 ; v1(68.2,32.16) 68.2,32.15 68.2,55.22 71.8,58.82 71.8,62.49
PA4: length 37.5
  Top Layer w0.152: v1(53.62,32.69) 53.64,32.71 U1.14 ; 64.18,14.23 64.18,12.87 63.41,12.11 62.05,12.11 60.54,10.59 58.5,10.59 J2.14
  Bottom Layer w0.152: v1(53.62,32.69) 53.62,18.77 57.1,15.29 J2.14
PA5: length 72.3
  Top Layer w0.152: v1(38.05,54.23) 39.42,52.86 v1(51.74,52.86) ; v1(54.13,33.27) 54.14,33.29 U1.15 54.14,38.24 v1(54.13,38.25)
  Bottom Layer w0.152: v1(54.13,33.27) 54.13,19.15 57.58,15.7 57.58,12.24 58.39,11.43 58.39,7.9 J2.15 ; v1(38.05,54.23) 37.26,55.02 37.26,62.49 ; v1(51.74,52.86) 52.76,51.84 52.76,41.99 54.13,40.61 v1(54.13,38.25)
PA6: length 82.6
  Top Layer w0.152: v1(54.64,33.86) 54.64,33.86 U1.16 54.64,38.81 v1(54.64,38.81) ; v1(40.67,54.91) 41.96,53.62 v1(51.66,53.62) ; J2.16 61.93,11.48 63.78,11.48 65.48,13.18 65.48,17.73 v1(66.37,18.62)
  Bottom Layer w0.152: v1(40.67,54.91) 39.8,55.78 39.8,62.49 ; v1(54.64,38.81) 54.64,40.77 53.14,42.27 53.14,52.35 51.87,53.62 v1(51.66,53.62) ; v1(54.64,33.86) 54.64,21.23 60.17,15.7 60.17,12.21 59.64,11.67 J2.16 ; R34.1 66.87,19.12 v1(66.37,18.62)
PA7: length 69
  Top Layer w0.152: v1(52.27,54.18) 43.94,54.18 v1(42.44,55.68) ; v1(55.14,39.39) 55.14,39.39 U1.17 55.14,32.69 v1(55.12,32.66)
  Bottom Layer w0.152: v1(55.12,32.66) 55.12,21.67 60.6,16.18 60.6,10.41 60.91,10.11 60.91,7.92 J2.17 ; v1(42.44,55.68) 42.44,62.39 42.34,62.49 ; v1(55.14,39.39) 55.14,40.92 53.54,42.52 53.54,52.91 v1(52.27,54.18)
PA8: length 54.9
  Top Layer w0.152: U1.29 66.04,38.79 v1(66.04,38.79) ; 56.56,62.49 58.35,64.29 64.03,64.29 65.91,66.17 65.91,68.91 J1.5
  Bottom Layer w0.152: J1.5 66.01,68.81 66.01,66.88 68.15,64.74 68.15,59.56 65.99,57.4 65.99,38.84 v1(66.04,38.79)
PA9: length 120.5
  Top Layer w0.152: v1(65.43,39.29) 65.43,39.29 U1.30 ; v1(65.41,28.78) 27.1,28.78 24.1,31.78 ; 49.96,62.49 52.31,64.85 62,64.85 J1.6 ; J8.2 v1(65.41,54.53)
  Bottom Layer w0.152: 65.38,54.53 65.38,58.39 67.82,60.83 67.82,64.47 J1.6 ; 65.38,54.53 65.38,54.53 v1(65.41,54.53) ; 65.38,54.53 65.38,39.34 v1(65.43,39.29) 65.41,39.27 v1(65.41,28.78)
PA10: length 106.1
  Top Layer w0.152: v1(64.8,39.8) 64.78,39.79 U1.31 ; v1(64.69,51.66) 79.73,51.66 J8.3 ; v1(64.39,28.19) 26.57,28.19 24.59,30.17 R9.2
  Bottom Layer w0.152: J1.7 62.18,69.44 63.47,68.15 63.47,66.85 64.67,65.66 64.67,65.62 66.72,63.57 66.72,60.73 64.69,58.7 v1(64.69,51.66) 64.8,51.56 v1(64.8,39.8) 64.8,28.6 v1(64.39,28.19)
PA11: length 33.1
  Top Layer w0.152: v1(64.21,40.77) 63.73,40.29 U1.32
  Bottom Layer w0.152: J1.8 64.57,65.18 64.57,65.15 65.63,64.08 65.63,60.81 64.22,59.39 64.22,40.77 v1(64.21,40.77)
PA12: length 36.2
  Top Layer w0.152: v1(63.65,41.3) 63.14,40.79 60.14,40.79
  Bottom Layer w0.152: v1(63.65,41.3) 63.73,41.38 63.73,59.59 65.3,61.16 65.3,63.63 63.02,65.91 61.93,65.91 60.88,66.95 60.88,68.86 J1.9
PA13/SWDIO: length 105.5
  Top Layer w0.152: U1.34 62.85,41.29 v1(62.89,41.33) ; U4.2 11.91,26.78 13.34,25.35 v1(62.41,25.35)
  Bottom Layer w0.152: v1(62.41,25.35) 62.92,25.86 62.92,41.3 v1(62.89,41.33) 62.89,43.55 63.27,43.93 63.27,60.22 62.89,60.6 62.89,63.3 62.24,63.94 61.81,63.94 59.64,66.12 J1.10
PA14/SWCLK: length 101.6
  Top Layer w0.152: U4.3 12.56,29 15.7,25.86 v1(59.56,25.86) ; 58.64,43.79 58.64,45.38 v1(58.65,45.39)
  Bottom Layer w0.152: J1.13 55.8,68.86 55.8,66.27 57.68,64.39 57.68,60.27 58.65,59.31 v1(58.65,45.39) 58.67,45.39 59.94,44.12 59.94,26.24 v1(59.56,25.86)
PA15: length 37
  Top Layer w0.152: 58.14,43.79 v1(58.14,46.08) ; v1(47.75,57.91) v1(58.14,57.91)
  Bottom Layer w0.152: v1(58.14,46.08) v1(58.14,57.91) 58.14,58.5 55.5,61.14 55.5,65.1 54.56,66.04 J1.14 ; R39.1 47.72,57.95 v1(47.75,57.91)
PB0: length 37.1
  Top Layer w0.152: 66.72,14.23 66.72,12.13 65.46,10.87 63.86,10.87 J2.18 ; v1(55.63,33.27) 55.64,33.29 U1.18
  Bottom Layer w0.152: J2.18 62.18,10.75 62.71,11.28 62.71,15.44 55.63,22.53 v1(55.63,33.27)
PB1: length 49.5
  Top Layer w0.152: U1.19 56.14,33.86 v1(56.13,33.86) ; v1(70.74,11.71) 70.05,11.02 66.8,11.02 66.04,10.26 66.04,7.97 J2.19
  Bottom Layer w0.152: J2.19 63.45,7.92 63.45,11.56 63.07,11.94 63.07,16.1 56.13,23.04 v1(56.13,33.86) ; v1(70.74,11.71) 70.74,18.03 71.86,19.14
PB2: length 29.9
  Top Layer w0.152: v1(56.64,33.27) 56.64,33.28 U1.20
  Bottom Layer w0.152: v1(56.64,33.27) 56.64,33.27 56.64,23.78 65.3,15.11 65.3,11.58 64.72,11 J2.20
PB3: length 36.6
  Top Layer w0.152: 61.64,62.49 61.64,59.84 60.35,58.55 v1(56.87,58.55) ; 57.64,43.79 57.64,46.7 v1(57.63,46.71)
  Bottom Layer w0.152: J1.15 53.29,68.84 53.29,65.99 55.14,64.14 55.14,60.27 v1(56.87,58.55) 56.87,58.01 57.63,57.25 v1(57.63,46.71)
PB4: length 33.2
  Top Layer w0.152: 59.1,62.49 59.08,62.47 59.08,60.33 58.7,59.94 v1(54.13,59.94) ; v1(57.15,45.42) 57.14,45.41 57.14,43.79
  Bottom Layer w0.152: v1(57.15,45.42) 57.15,56.92 v1(54.13,59.94) 52.6,61.47 52.6,65.73 52.02,66.32 J1.16
PB5: length 43.3
  Top Layer w0.152: v1(51.66,65.81) v1(61.01,65.81) ; v1(56.64,46.02) 56.64,46.02 56.64,43.79
  Bottom Layer w0.152: v1(51.66,65.81) 52.17,65.3 52.17,61.06 56.64,56.59 v1(56.64,46.02) ; v1(61.01,65.81) 64.18,62.64 64.18,62.49 ; J1.17 50.72,68.86 50.72,66.73 51.64,65.81
PB6: length 38.1
  Top Layer w0.152: 56.14,43.79 56.14,46.71 v1(56.13,46.71) ; v1(55.47,56.9) v1(45.31,56.9)
  Bottom Layer w0.152: J1.18 49.48,65.94 51.64,63.78 51.64,60.73 v1(55.47,56.9) 56.13,56.24 v1(56.13,46.71) ; v1(45.31,56.9) 44.86,57.35 R38.2
PB7: length 32.2
  Top Layer w0.152: 55.64,43.79 55.64,45.41 v1(55.65,45.42)
  Bottom Layer w0.152: J1.19 48.16,68.89 48.16,64.85 47.42,64.1 47.42,61.27 48.08,60.6 50.88,60.6 55.65,55.83 v1(55.65,45.42)
PB8: length 94.7
  Top Layer w0.152: 27.1,62.49 27.1,63.75 28.68,65.33 v1(45.62,65.33) ; v1(72.57,27.66) v1(58.88,27.66) ; v1(58.27,42.29) 58.24,42.32 55.07,42.32 54.64,42.74 54.64,46.49 v1(54.66,46.51)
  Bottom Layer w0.152: v1(58.88,27.66) 58.88,41.68 v1(58.27,42.29) ; R36.1 73.48,26.75 v1(72.57,27.66) ; J1.21 45.62,68.89 v1(45.62,65.33) 45.97,64.97 45.97,61.49 48.01,59.46 50.01,59.46 54.66,54.81 v1(54.66,46.51)
PB9: length 87.2
  Top Layer w0.152: v1(58.32,41.55) 57.91,41.96 54.69,41.96 54.14,42.51 54.14,45.73 v1(54.1,45.77) ; v1(52.32,54.86) 45.26,54.86 v1(43.87,56.26) ; v1(43.59,64.62) 30.56,64.62 29.64,63.7 29.64,62.49 ; v1(68.71,29.29) 68.68,29.31 v1(58.34,29.31)
  Bottom Layer w0.152: R35.1 69.27,21.01 68.71,21.56 v1(68.71,29.29) ; v1(54.1,45.77) 54.1,53.09 v1(52.32,54.86) ; v1(58.32,41.55) 58.34,41.53 v1(58.34,29.31) ; J1.22 43.59,66.75 v1(43.59,64.62) 43.59,56.54 v1(43.87,56.26)
PB10: length 72.5
  Top Layer w0.152: U1.21 57.14,32.65 v1(57.15,32.64) 57.18,32.61 v1(61.14,32.61) ; v1(58.34,60.66) 54.64,60.66 54.02,61.27 54.02,62.49
  Bottom Layer w0.152: J2.21 65.96,7.95 65.96,12.09 65.61,12.45 65.61,16.1 57.15,24.56 v1(57.15,32.64) ; v1(58.34,60.66) 61.93,57.07 61.93,44.88 61.11,44.07 61.11,32.64 v1(61.14,32.61)
PB11: length 83.1
  Top Layer w0.152: v1(25.17,34.26) 31.27,34.26 34.6,30.94 v1(57.66,30.94) 70.33,30.94 v1(70.36,30.91) 70.38,30.94 73.69,30.94 74.72,31.97 J7.8 ; U1.22 57.64,33.64 v1(57.63,33.63)
  Bottom Layer w0.152: v1(57.63,33.63) 57.66,33.6 v1(57.66,30.94) ; v1(70.36,30.91) 70.36,12.24 67.31,9.19 J2.22 ; v1(25.17,34.26) 25.05,34.26 R57.1
PB12: length 50
  Top Layer w0.152: J7.7 71.45,34.57 v1(69.24,36.78) 69.23,36.79 U1.25
  Bottom Layer w0.152: J1.1 71.6,68.31 71.6,66.6 74.04,64.16 74.04,59.77 69.27,54.99 69.27,36.8 v1(69.24,36.78)
PB13: length 46.8
  Top Layer w0.152: 60.14,37.29 v1(68.71,37.29) 69.85,37.29 72.18,39.62 J7.3
  Bottom Layer w0.152: v1(68.71,37.29) 68.71,55.07 73.41,59.77 73.41,63.96 J1.2
PB14: length 48.9
  Top Layer w0.152: J7.1 72.18,42.16 67.81,37.79 67.65,37.79 ; v1(67.67,37.77) 67.65,37.79 ; 67.65,37.79 U1.27
  Bottom Layer w0.152: v1(67.67,37.77) 67.67,55.7 70.64,58.67 70.64,64.72 68.55,66.8 68.55,68.81 J1.3
PB15: length 48
  Top Layer w0.152: U1.28 67.12,38.29 69.67,40.84 v1(69.88,40.84)
  Bottom Layer w0.152: v1(69.88,40.84) 73.53,40.84 J7.4 ; J1.4 70.28,64.54 70.28,59.28 67.13,56.13 v1(67.13,38.3)
PC13: length 66.3
  Top Layer w0.152: U1.2 50.44,41.79 46.23,46 33.96,46 v1(33.07,45.11) ; v1(32.89,13.61) 32.84,13.67 31.25,13.67 ; v2(34.57,9.19) J2.2
  Bottom Layer w0.152: v2(34.57,9.19) 32.89,10.87 v1(32.89,13.61) 32.89,44.93 v1(33.07,45.11)
PC14: length 61.1
  Top Layer w0.152: J2.3 43.13,7.92 43.13,9.96 42.29,10.79 v1(34.09,10.79) ; v1(44.04,45.42) 34.42,45.42 v1(33.43,44.42)
  Bottom Layer w0.152: v1(34.09,10.79) 33.43,11.46 v1(33.43,44.42) ; v1(44.04,45.42) 45.38,44.08 R24.2
PC14/LEXT_IN: length 6.8
  Top Layer w0.152: U1.3 49.82,41.29 47.93,43.18 v1(47.37,43.18) R22.2
  Bottom Layer w0.152: R24.1 47.24,43.05 v1(47.37,43.18)
PC15: length 58.4
  Top Layer w0.152: v1(34.85,44.83) 34.9,44.88 v1(43.43,44.88) ; J2.4 44.4,9.68 42.75,11.33 34.42,11.33 v1(34.14,11.61)
  Bottom Layer w0.152: v1(34.85,44.83) 33.81,43.79 33.81,11.94 v1(34.14,11.61) ; v1(43.43,44.88) 44.07,44.25 44.07,42.32 44.88,41.5 R25.2
PC15/LEXT_OUT: length 6.4
  Top Layer w0.152: R23.2 46.55,41.38 v1(47.45,41.38) 49.02,41.38 49.61,40.79 51.64,40.79
  Bottom Layer w0.152: v1(47.45,41.38) 46.61,41.38 R25.1
PF0: length 26.9
  Bottom Layer w0.152: R28.2 45.14,32.73 45.14,10.62 45.62,10.13 45.62,7.97 J2.5
PF0/HEXT_IN: length 11.6
  Top Layer w0.152: v1(45.85,38.66) 46.5,39.31 R26.2 47.34,40.29 U1.5
  Bottom Layer w0.152: v1(45.85,38.66) 45.85,35.97 45.06,35.18 R28.1
PF1: length 24.3
  Bottom Layer w0.152: J2.6 47.5,9.75 47.5,24.83 46.51,25.82 R29.2
PF1/HEXT_OUT: length 10.3
  Top Layer w0.152: U1.6 47.76,39.79 47.37,39.39 47.37,38.49 R27.2 46.55,36.38 v1(46.56,36.37)
  Bottom Layer w0.152: v1(46.56,36.37) 46.56,33.99 R29.1
PF6: length 85.7
  Top Layer w0.152: v1(62.31,41.81) 62.29,41.79 U1.35 ; v1(62.15,30.2) 61.8,29.84 30.81,29.84 v1(30.28,29.31)
  Bottom Layer w0.152: v1(30.28,29.31) 30.28,27.71 29.49,26.92 25.07,26.92 R53.1 ; v1(62.15,30.2) 62.31,30.35 v1(62.31,41.81) 62.31,43.69 62.81,44.2 62.81,59.13 60.53,61.42 60.53,64.47 58.39,66.6 58.39,68.81 J1.11
PF7: length 79.3
  Top Layer w0.152: v1(61.65,42.29) 61.64,42.29 U1.36 ; v1(26.09,30.68) 33.96,30.68 34.26,30.38 v1(61.21,30.38)
  Bottom Layer w0.152: v1(26.09,30.68) 25.1,30.68 R54.1 ; J1.12 57.1,66.72 60.15,63.68 60.15,60.98 62.38,58.75 62.38,44.48 61.65,43.74 v1(61.65,42.29) 61.65,30.81 v1(61.21,30.38)
USB+: length 10
  Top Layer w0.152: 12.95,67.44 12.32,67.44 11.95,67.81 CN6.B6 ; 12.95,67.44 12.95,65.79 13.59,65.15 v1(14.36,65.15) R11.1 ; 12.95,67.44 CN6.A6
  Bottom Layer w0.152: TP1.3 13.67,65.15 v1(14.36,65.15)
USB-: length 9.4
  Top Layer w0.152: CN6.A7 12.45,70.62 12.7,70.87 13.21,70.87 13.45,70.62 CN6.B7 13.45,67.07 13.84,66.67 v1(14.39,66.67) R12.1
  Bottom Layer w0.152: 13.31,67.34 13.97,66.67 v1(14.39,66.67)
$1N349: length 3.3
  Top Layer w0.152: v1(3.2,55.04) 3.15,55.09 3.15,56.03
  Bottom Layer w0.152: RP1.5 4.37,55.53 3.89,55.04 v1(3.2,55.04)
$1N350: length 2.6
  Top Layer w0.152: v1(2.92,57.02) 2.92,57.73 LD3.1
  Bottom Layer w0.152: RP1.6 4.07,57.38 3.71,57.02 v1(2.92,57.02)
$1N351: length 2.8
  Top Layer w0.152: v1(2.92,58.93) 2.92,59.69 LD2.1
  Bottom Layer w0.152: v1(2.92,58.93) 3.57,58.28 RP1.7
$1N352: length 5.4
  Top Layer w0.152: 3.13,61.8 2.47,61.8 v1(1.93,61.26)
  Bottom Layer w0.152: v1(1.93,61.26) 1.93,60.17 2.39,59.72 3.66,59.72 4.19,59.18 RP1.8
$1N495: length 4
  Top Layer w0.381: U7.4 14.73,61.47 15.12,61.86 R43.1 R49.2
$1N28282: length 20.6
  Top Layer w0.381: 9.26,63.19 9.44,63.37 U7.1 12.17,63.37 12.55,62.99 12.55,61.47 ; 9.26,63.19 7.5,63.19 ; 9.26,63.19 C16.2 ; D3.2 20.29,59.08 19.41,59.97 13.13,59.97 12.55,60.55 12.55,61.47 ; 7.5,63.19 C15.2 ; 7.5,63.19 F2.2 ; 12.55,61.47 U7.3
$2N102: length 6.2
  Top Layer w0.152: R26.1 43.7,38.15 42.15,38.15 Y2.1 41.73,38.03 40.73,39.03 C25.2
$2N103: length 10.5
  Top Layer w0.152: 38.22,35.63 38.26,35.63 39.33,34.56 C26.2 ; 38.22,35.63 39.37,36.78 44.15,36.78 45.04,37.67 ; 38.22,35.63 Y2.3
$2N208: length 4.4
  Top Layer w0.152: C24.2 Y1.2 44.67,41.7 R23.1
$2N210: length 4.3
  Top Layer w0.152: R22.1 44.98,43.2 Y1.1 C23.2
$2N318: length 2.7
  Top Layer w0.152: JP1.2 59.53,51.24 R31.1
$3N170: length 2.8
  Top Layer w0.254: R15.1 26.97,35.2 26.97,35.21
$3N172: length 2.8
  Top Layer w0.254: LED4.1 26.92,37.01 R16.1
$3N175: length 4.1
  Top Layer w0.152: v1(29.72,34.85) 29.36,35.21 28.52,35.21
  Bottom Layer w0.152: v1(29.72,34.85) 29.72,34.04 29.04,33.36 Q2.3
$3N177: length 2.6
  Top Layer w0.152: v1(29.64,36.68) 29.28,37.04 LED4.2
  Bottom Layer w0.152: v1(29.64,36.68) 29.64,35.97 29.59,35.92 Q3.3
$3N21573: length 15.6
  Top Layer w0.152: 22.05,9.33 B2.3 30.05,13.59 R6.1 30.01,13.78 R7.2 29.98,15.16 R5.1
$3N23578: length 10.8
  Top Layer w0.152: 22.61,31.78 14.28,31.78 13.86,32.19 U4.5
$3N26346: length 3.9
  Top Layer w0.254: v1(22.35,49.2) 22.35,50.37 U2.4
  Bottom Layer w0.254: R51.2 R50.1 22.54,49.01 v1(22.35,49.2)
$3N27254: length 1.9
  Top Layer w0.254: R3.1 26.91,40.91 LED1.1
$3N29129: length 12.8
  Top Layer w0.152: 22.59,30.17 14.02,30.17 13.21,30.99 U4.4
$3N31026: length 2.9
  Top Layer w0.254: R14.1 26.99,33.45 LED2.1
$3N31027: length 5.2
  Top Layer w0.152: v1(29.59,31.32) 29.59,32.41 LED2.2
  Bottom Layer w0.152: v1(29.59,31.32) 29.59,30.38 29.02,29.8 Q1.3
$3N31068: length 4.4
  Bottom Layer w0.152: R52.2 23.98,29.41 24.03,29.46 ; 27.32,27.93 27.21,28.04 R53.2 25.4,28.04 24.03,29.41 24.03,29.46 ; 24.03,29.46 24.19,29.62 ; 24.03,29.46 23.95,29.55
$3N31207: length 4.1
  Bottom Layer w0.152: 27.32,31.46 25.83,31.46 R54.2 24.1,33.2 R55.2
$3N31389: length 3.9
  Bottom Layer w0.152: 25.28,35.38 25.28,35.39 24.16,36.51 24.16,36.73 ; 25.44,35.45 R57.2 25.86,34.97 27.32,34.97
$4N197: length 5.2
  Bottom Layer w0.152: 69.2,17.55 67.72,17.55 R34.2 ; 69.2,17.55 69.2,17.75 R35.2 ; 69.2,17.55 69.26,17.55 69.26,14.23
$4N198: length 5.2
  Bottom Layer w0.152: 71.8,14.23 71.86,14.29 R37.2 71.89,17.6 73.26,17.6 R36.2
$4N262: length 4.8
  Bottom Layer w0.152: 44.88,62.49 44.88,59.31 46.28,59.31 R39.2
  Bottom Layer w0.254: 44.88,59.31 R38.1

## Copper pours and planes (outline as drawn; the poured copper is in the pictures)
GND on Top Layer: -1.04,77.62 88.37,77.62 88.37,-0.81 -1.04,-0.81
GND on Bottom Layer: -0.61,78.05 88.54,78.05 88.54,-0.38 -0.61,-0.38

Small or netless copper shapes (teardrops, artwork), in the pictures only: 530 on Top Layer, 357 on Bottom Layer

## Text on the board
Bottom Silkscreen Layer: VCC | 1 | 2 | 3 | 4 | 5 | 6 | 8 | 7 | 9 | 48 | 47 | 46 | 45 | 44 | 43 | 41 | 42 | 10 | 39 | 40 | 11 | 12 | 37 | 38 | 13 | 14 | 36 | 35 | 15 | 16 | 34 | 33 | 18 | 17 | 31 | 32 | 20 | 19 | 29 | 30 | 21 | 22 | 27 | 28 | 24 | 25 | 26 | 23 | AT32L021C8T7
Top Silkscreen Layer: BOOT0 | VDD | C13 | GND | C15* | C14* | B9 | B8 | F1* | F0* | B7 | NRST | B6 | NC | B5 | B4 | A0 | B3 | A14 | A2 | A15 | A1 | A3 | F6 | A4 | F7 | A12 | A13 | A6 | A5 | A10 | B0 | A11 | A7 | A8 | B2 | A9 | B1 | B14 | B11 | B10 | B15 | B12 | B13 | 1 | 47 | 11 | 35 | 25 | 23 | DIGITAL(#=PWM) | POWER | ANALOG IN | RESET | MISO | SCK | NSS | MOSI | PB11 | 5V | USART1_RX | USART1_TX | 8 | 7 | 4 | 2 | SCL | SDA | VDDA | 13 | IOREF | 12 | #11 | #10 | #9 | #6 | AN0 | #5 | AN1 | AN2 | #3 | AN3 | AN4 | TX | AN5 | RX 0 | USER | 3V3 | SWD | SWC | E5V | RX | - | VDD_MCU | 1.8V | 3.3V | IDD | 3 | LD: | AT-Link | AT-Link-EZ V1.4 | AT-START-L021 V1.0
